# Altium schematic sheet Sitara_Main_Power.SchDoc
size A3; SheetNumber: 4; SheetTotal: 5
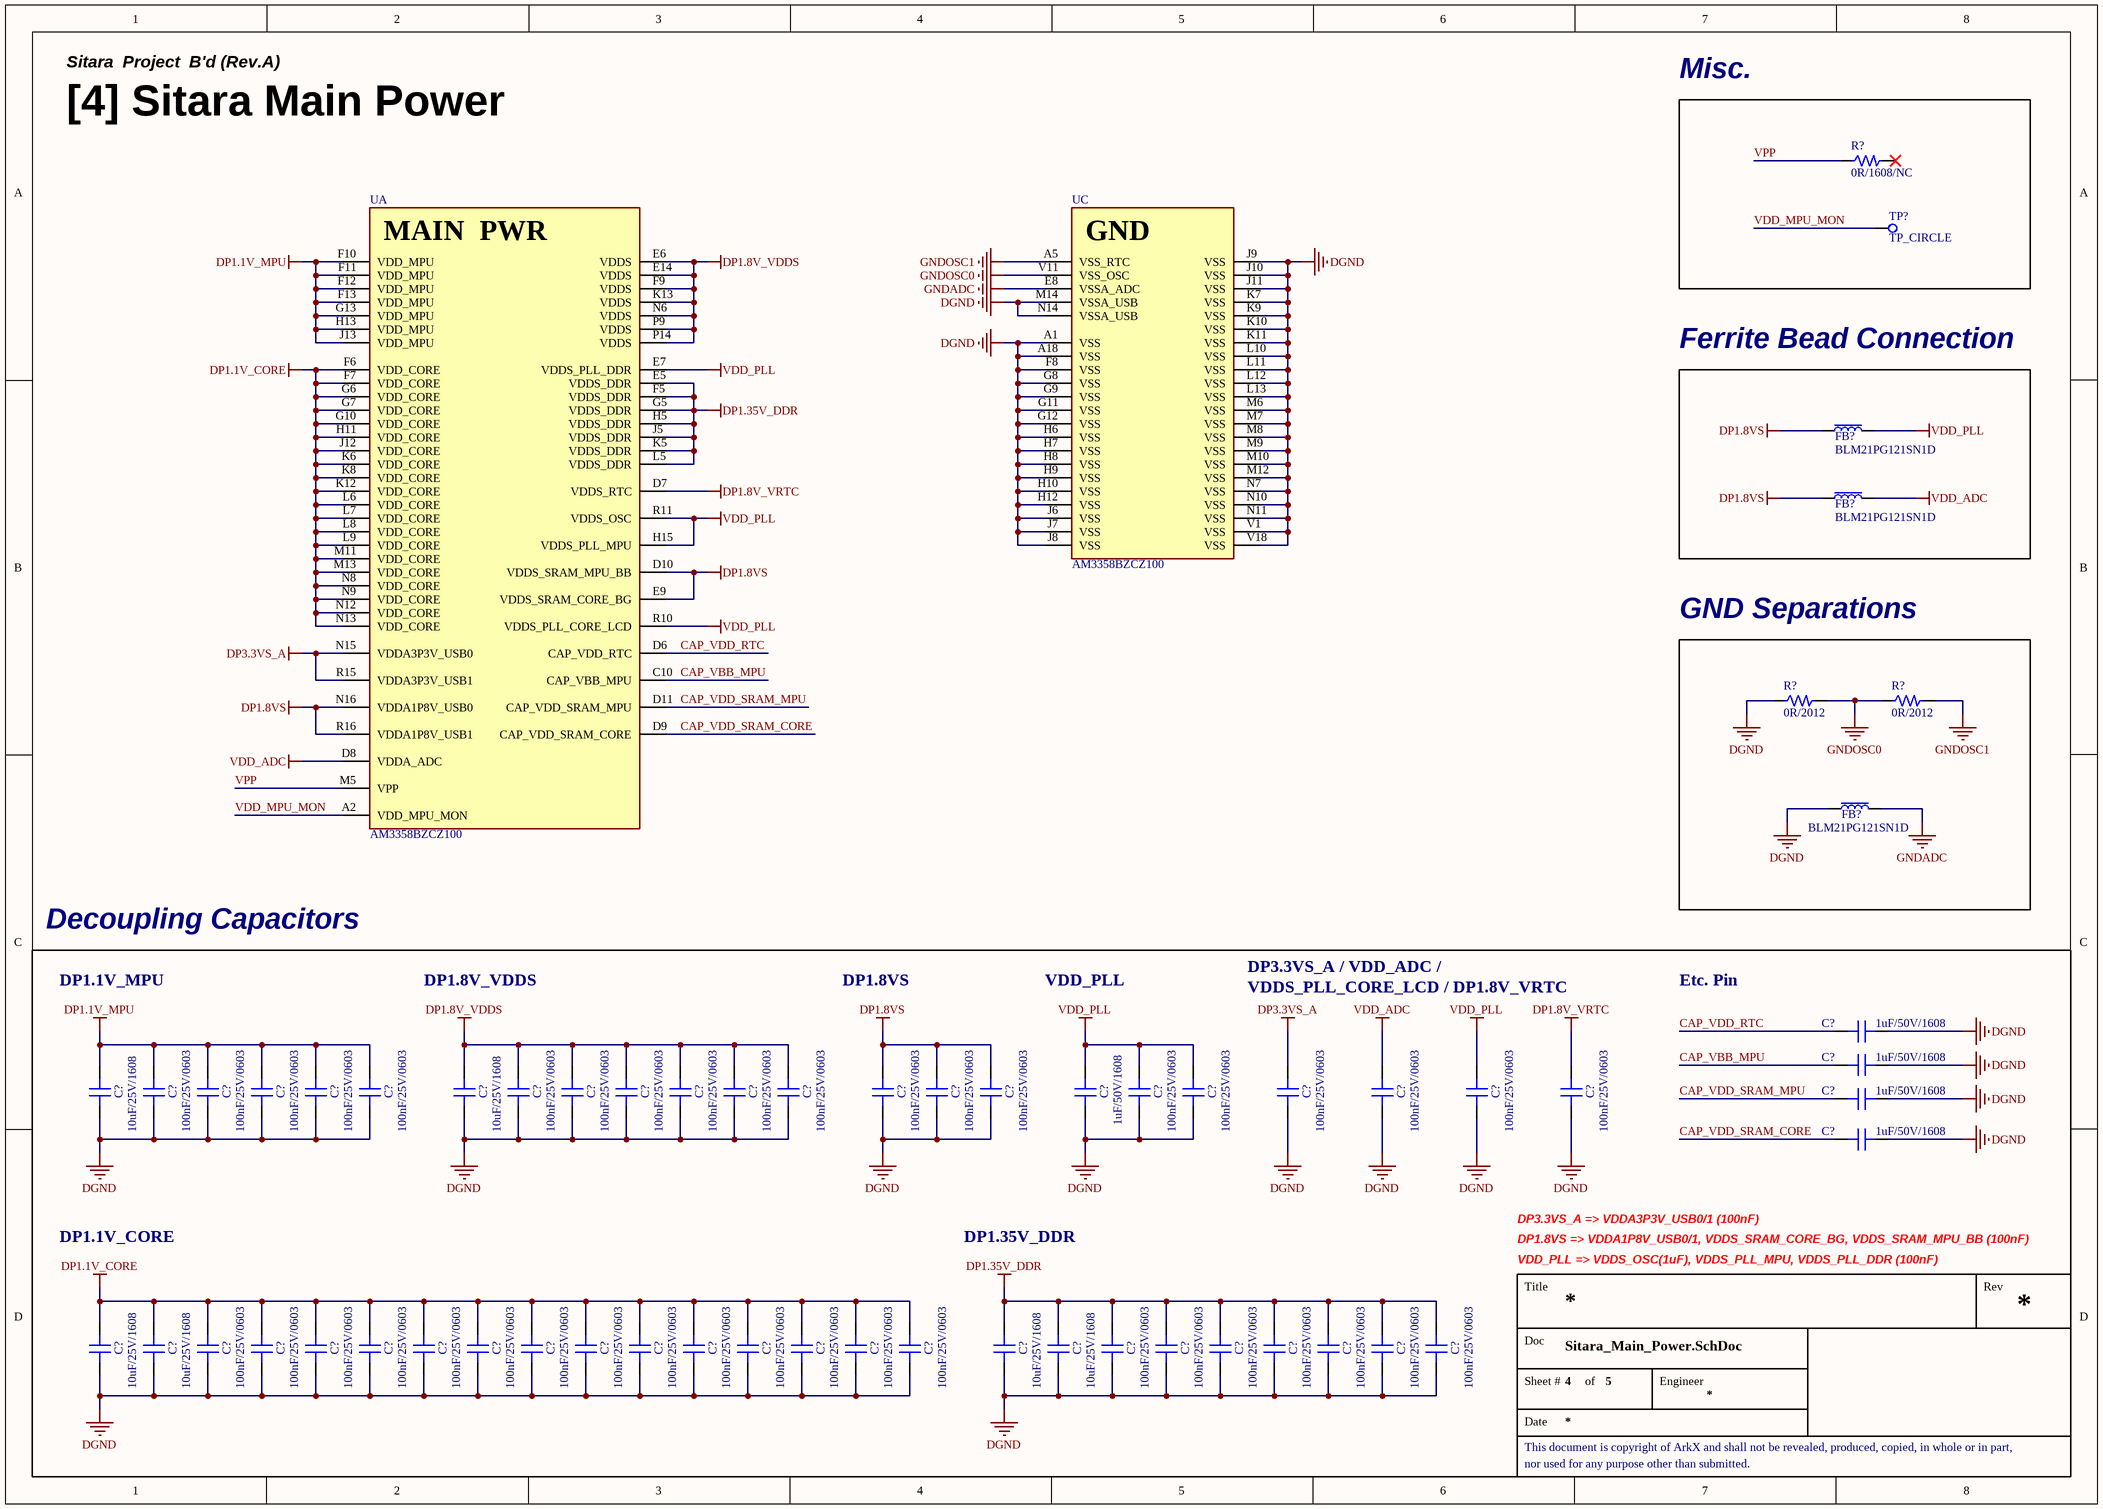
[diagram p0: Sitara_Main_Power.SchDoc]

## Parts
(Parts that share a designator on the sheet are numbered #1, #2 ... from top to bottom, then left to right.)
C?#1  1uF/50V/1608  [CAP 1608 (0603_INCH)]
C?#2  1uF/50V/1608  [CAP 1608 (0603_INCH)]
C?#3  10uF/25V/1608  [CAP 1608 (0603_INCH)]
C?#4  100nF/25V/0603  [CAP 0603 (0201_INCH)]
C?#5  100nF/25V/0603  [CAP 0603 (0201_INCH)]
C?#6  100nF/25V/0603  [CAP 0603 (0201_INCH)]
C?#7  100nF/25V/0603  [CAP 0603 (0201_INCH)]
C?#8  100nF/25V/0603  [CAP 0603 (0201_INCH)]
C?#9  10uF/25V/1608  [CAP 1608 (0603_INCH)]
C?#10  100nF/25V/0603  [CAP 0603 (0201_INCH)]
C?#11  100nF/25V/0603  [CAP 0603 (0201_INCH)]
C?#12  100nF/25V/0603  [CAP 0603 (0201_INCH)]
C?#13  100nF/25V/0603  [CAP 0603 (0201_INCH)]
C?#14  100nF/25V/0603  [CAP 0603 (0201_INCH)]
C?#15  100nF/25V/0603  [CAP 0603 (0201_INCH)]
C?#16  100nF/25V/0603  [CAP 0603 (0201_INCH)]
C?#17  100nF/25V/0603  [CAP 0603 (0201_INCH)]
C?#18  100nF/25V/0603  [CAP 0603 (0201_INCH)]
C?#19  1uF/50V/1608  [CAP 1608 (0603_INCH)]
C?#20  100nF/25V/0603  [CAP 0603 (0201_INCH)]
C?#21  100nF/25V/0603  [CAP 0603 (0201_INCH)]
C?#22  100nF/25V/0603  [CAP 0603 (0201_INCH)]
C?#23  100nF/25V/0603  [CAP 0603 (0201_INCH)]
C?#24  100nF/25V/0603  [CAP 0603 (0201_INCH)]
C?#25  100nF/25V/0603  [CAP 0603 (0201_INCH)]
C?#26  1uF/50V/1608  [CAP 1608 (0603_INCH)]
C?#27  1uF/50V/1608  [CAP 1608 (0603_INCH)]
C?#28  10uF/25V/1608  [CAP 1608 (0603_INCH)]
C?#29  10uF/25V/1608  [CAP 1608 (0603_INCH)]
C?#30  100nF/25V/0603  [CAP 0603 (0201_INCH)]
C?#31  100nF/25V/0603  [CAP 0603 (0201_INCH)]
C?#32  100nF/25V/0603  [CAP 0603 (0201_INCH)]
C?#33  100nF/25V/0603  [CAP 0603 (0201_INCH)]
C?#34  100nF/25V/0603  [CAP 0603 (0201_INCH)]
C?#35  100nF/25V/0603  [CAP 0603 (0201_INCH)]
C?#36  100nF/25V/0603  [CAP 0603 (0201_INCH)]
C?#37  100nF/25V/0603  [CAP 0603 (0201_INCH)]
C?#38  100nF/25V/0603  [CAP 0603 (0201_INCH)]
C?#39  100nF/25V/0603  [CAP 0603 (0201_INCH)]
C?#40  100nF/25V/0603  [CAP 0603 (0201_INCH)]
C?#41  100nF/25V/0603  [CAP 0603 (0201_INCH)]
C?#42  100nF/25V/0603  [CAP 0603 (0201_INCH)]
C?#43  100nF/25V/0603  [CAP 0603 (0201_INCH)]
C?#44  10uF/25V/1608  [CAP 1608 (0603_INCH)]
C?#45  10uF/25V/1608  [CAP 1608 (0603_INCH)]
C?#46  100nF/25V/0603  [CAP 0603 (0201_INCH)]
C?#47  100nF/25V/0603  [CAP 0603 (0201_INCH)]
C?#48  100nF/25V/0603  [CAP 0603 (0201_INCH)]
C?#49  100nF/25V/0603  [CAP 0603 (0201_INCH)]
C?#50  100nF/25V/0603  [CAP 0603 (0201_INCH)]
C?#51  100nF/25V/0603  [CAP 0603 (0201_INCH)]
C?#52  100nF/25V/0603  [CAP 0603 (0201_INCH)]
FB?#1  BLM21PG121SN1D  [FB 2012 (0805_inch)]
FB?#2  BLM21PG121SN1D  [FB 2012 (0805_inch)]
FB?#3  BLM21PG121SN1D  [FB 2012 (0805_inch)]
R?#1  0R/1608/NC  [RES 1608 (0603_inch)/NC]
R?#2  0R/2012  [RES 2012 (0805_inch)]
R?#3  0R/2012  [RES 2012 (0805_inch)]
TP?  TP_CIRCLE  [TP Circle]
U  AM3358BZCZ100  [BGA324C80P18X18_1500X1500X140]  (parts A,C of 8)

## Blocks framed on the sheet
Misc.: R?#1 TP?
Ferrite Bead Connection: FB?#1 FB?#2
GND Separations: FB?#3 R?#2 R?#3

## Nets
DGND: C?#1.2 C?#2.2 C?#3.1 C?#4.1 C?#5.1 C?#6.1 C?#7.1 C?#8.1 C?#9.1 C?#10.1 C?#11.1 C?#12.1 C?#13.1 C?#14.1 C?#15.1 C?#16.1 C?#17.1 C?#18.1 C?#19.1 C?#20.1 C?#21.1 C?#22.1 C?#23.1 C?#24.1 C?#25.1 C?#26.2 C?#27.2 C?#28.1 C?#29.1 C?#30.1 C?#31.1 C?#32.1 C?#33.1 C?#34.1 C?#35.1 C?#36.1 C?#37.1 C?#38.1 C?#39.1 C?#40.1 C?#41.1 C?#42.1 C?#43.1 C?#44.1 C?#45.1 C?#46.1 C?#47.1 C?#48.1 C?#49.1 C?#50.1 C?#51.1 C?#52.1 FB?#3.1 R?#2.1 U.A1(VSS) U.A18(VSS) U.F8(VSS) U.G8(VSS) U.G9(VSS) U.G11(VSS) U.G12(VSS) U.H6(VSS) U.H7(VSS) U.H8(VSS) U.H9(VSS) U.H10(VSS) U.H12(VSS) U.J6(VSS) U.J7(VSS) U.J8(VSS) U.J9(VSS) U.J10(VSS) U.J11(VSS) U.K7(VSS) U.K9(VSS) U.K10(VSS) U.K11(VSS) U.L10(VSS) U.L11(VSS) U.L12(VSS) U.L13(VSS) U.M6(VSS) U.M7(VSS) U.M8(VSS) U.M9(VSS) U.M10(VSS) U.M12(VSS) U.M14(VSSA_USB) U.N7(VSS) U.N10(VSS) U.N11(VSS) U.N14(VSSA_USB) U.V1(VSS) U.V18(VSS)
DP1.1V_CORE: C?#28.2 C?#29.2 C?#30.2 C?#31.2 C?#32.2 C?#33.2 C?#34.2 C?#35.2 C?#36.2 C?#37.2 C?#38.2 C?#39.2 C?#40.2 C?#41.2 C?#42.2 C?#43.2 U.F6(VDD_CORE) U.F7(VDD_CORE) U.G6(VDD_CORE) U.G7(VDD_CORE) U.G10(VDD_CORE) U.H11(VDD_CORE) U.J12(VDD_CORE) U.K6(VDD_CORE) U.K8(VDD_CORE) U.K12(VDD_CORE) U.L6(VDD_CORE) U.L7(VDD_CORE) U.L8(VDD_CORE) U.L9(VDD_CORE) U.M11(VDD_CORE) U.M13(VDD_CORE) U.N8(VDD_CORE) U.N9(VDD_CORE) U.N12(VDD_CORE) U.N13(VDD_CORE)
DP1.1V_MPU: C?#3.2 C?#4.2 C?#5.2 C?#6.2 C?#7.2 C?#8.2 U.F10(VDD_MPU) U.F11(VDD_MPU) U.F12(VDD_MPU) U.F13(VDD_MPU) U.G13(VDD_MPU) U.H13(VDD_MPU) U.J13(VDD_MPU)
DP1.8V_VDDS: C?#9.2 C?#10.2 C?#11.2 C?#12.2 C?#13.2 C?#14.2 C?#15.2 U.E6(VDDS) U.E14(VDDS) U.F9(VDDS) U.K13(VDDS) U.N6(VDDS) U.P9(VDDS) U.P14(VDDS)
DP1.8V_VRTC: C?#25.2 U.D7(VDDS_RTC)
DP1.8VS: C?#16.2 C?#17.2 C?#18.2 FB?#1.1 FB?#2.1 U.D10(VDDS_SRAM_MPU_BB) U.E9(VDDS_SRAM_CORE_BG) U.N16(VDDA1P8V_USB0) U.R16(VDDA1P8V_USB1)
DP1.35V_DDR: C?#44.2 C?#45.2 C?#46.2 C?#47.2 C?#48.2 C?#49.2 C?#50.2 C?#51.2 C?#52.2 U.E5(VDDS_DDR) U.F5(VDDS_DDR) U.G5(VDDS_DDR) U.H5(VDDS_DDR) U.J5(VDDS_DDR) U.K5(VDDS_DDR) U.L5(VDDS_DDR)
DP3.3VS_A: C?#22.2 U.N15(VDDA3P3V_USB0) U.R15(VDDA3P3V_USB1)
GNDADC: FB?#3.2 U.E8(VSSA_ADC)
GNDOSC0: R?#2.2 R?#3.1 U.V11(VSS_OSC)
GNDOSC1: R?#3.2 U.A5(VSS_RTC)
VDD_ADC: C?#23.2 FB?#2.2 U.D8(VDDA_ADC)
VDD_PLL: C?#19.2 C?#20.2 C?#21.2 C?#24.2 FB?#1.2 U.E7(VDDS_PLL_DDR) U.H15(VDDS_PLL_MPU) U.R10(VDDS_PLL_CORE_LCD) U.R11(VDDS_OSC)
CAP_VBB_MPU: C?#2.1 U.C10(CAP_VBB_MPU)
CAP_VDD_RTC: C?#1.1 U.D6(CAP_VDD_RTC)
CAP_VDD_SRAM_CORE: C?#27.1 U.D9(CAP_VDD_SRAM_CORE)
CAP_VDD_SRAM_MPU: C?#26.1 U.D11(CAP_VDD_SRAM_MPU)
VDD_MPU_MON: TP?.1(TP) U.A2(VDD_MPU_MON)
VPP: R?#1.1 U.M5(VPP)

Not connected (* = marked no-connect by the designer): R?#1 2*

## Notes on the sheet
- Sitara  Project  B'd (Rev.A)
- [4] Sitara Main Power
- Decoupling Capacitors
- DP1.1V_MPU
- DP1.8V_VDDS
- DP1.8VS
- VDD_PLL
- DP3.3VS_A / VDD_ADC /
- VDDS_PLL_CORE_LCD / DP1.8V_VRTC
- Etc. Pin
- DP1.1V_CORE
- DP1.35V_DDR
- DP3.3VS_A => VDDA3P3V_USB0/1 (100nF)
- DP1.8VS => VDDA1P8V_USB0/1, VDDS_SRAM_CORE_BG, VDDS_SRAM_MPU_BB (100nF)
- VDD_PLL => VDDS_OSC(1uF), VDDS_PLL_MPU, VDDS_PLL_DDR (100nF)
- Title
- Rev
- Doc
- Sheet #
- of
- Engineer
- This document is copyright of ArkX and shall not be revealed, produced, copied, in whole or in part,
- Date
- nor used for any purpose other than submitted.
- (in symbol IC_SOC_AM3358BZCZ100, part A) MAIN  PWR
- (in symbol IC_SOC_AM3358BZCZ100, part C) GND

## Library data of the parts
C?#1 C?#2 C?#19 C?#26 C?#27 = CAP_1uF/50V/1608: Ceramic CAP_1uF/50V/1608; LCSC Part #: C15849; JLCPCB Part Type: Basic Part
C?#3 C?#9 C?#28 C?#29 C?#44 C?#45 = CAP_10uF/25V/1608: Ceramic CAP_10uF/25V/1608; LCSC Part #: C96446; JLCPCB Part Type: Basic Part
C?#4-C?#8 C?#10-C?#18 C?#20-C?#25 C?#30-C?#43 C?#46-C?#52 = CAP_100nF/25V/0603: Ceramic CAP_100nF/25V/0603; JLCPCB Part Type: Extended Part; LCSC Part #: C181047
FB?#1-FB?#3 = FB_BLM21PG121SN1D: 3A 1 30mΩ 120Ω@100MHz ±25% 0805  Ferrite Beads ROHS; LCSC Part #: C79382; JLCPCB Part Type: Extended Part
R?#1 = RES_NC_0R/1608/0.1W: 0R/1608/0.1W/NC; Value: 0R; Power Rating: 0.1W; Precision: 1%; Size: 1608
R?#2 R?#3 = RES_0R/2012/0.125W: Value: 0R; Power Rating: 0.125W; Precision: 1%; Size: 2012; LCSC Part #: C17477; JLCPCB Part Type: Basic Part
U = IC_SOC_AM3358BZCZ100: ARM® Cortex®-A8 Microprocessor IC Sitara™ 1 Core, 32-Bit 1.0GHz 324-NFBGA (15x15); LCSC Part #: C73932; JLCPCB Part Type: Extended Part